# EAGLE schematic witch-dekatron1 (EAGLE 6.4)
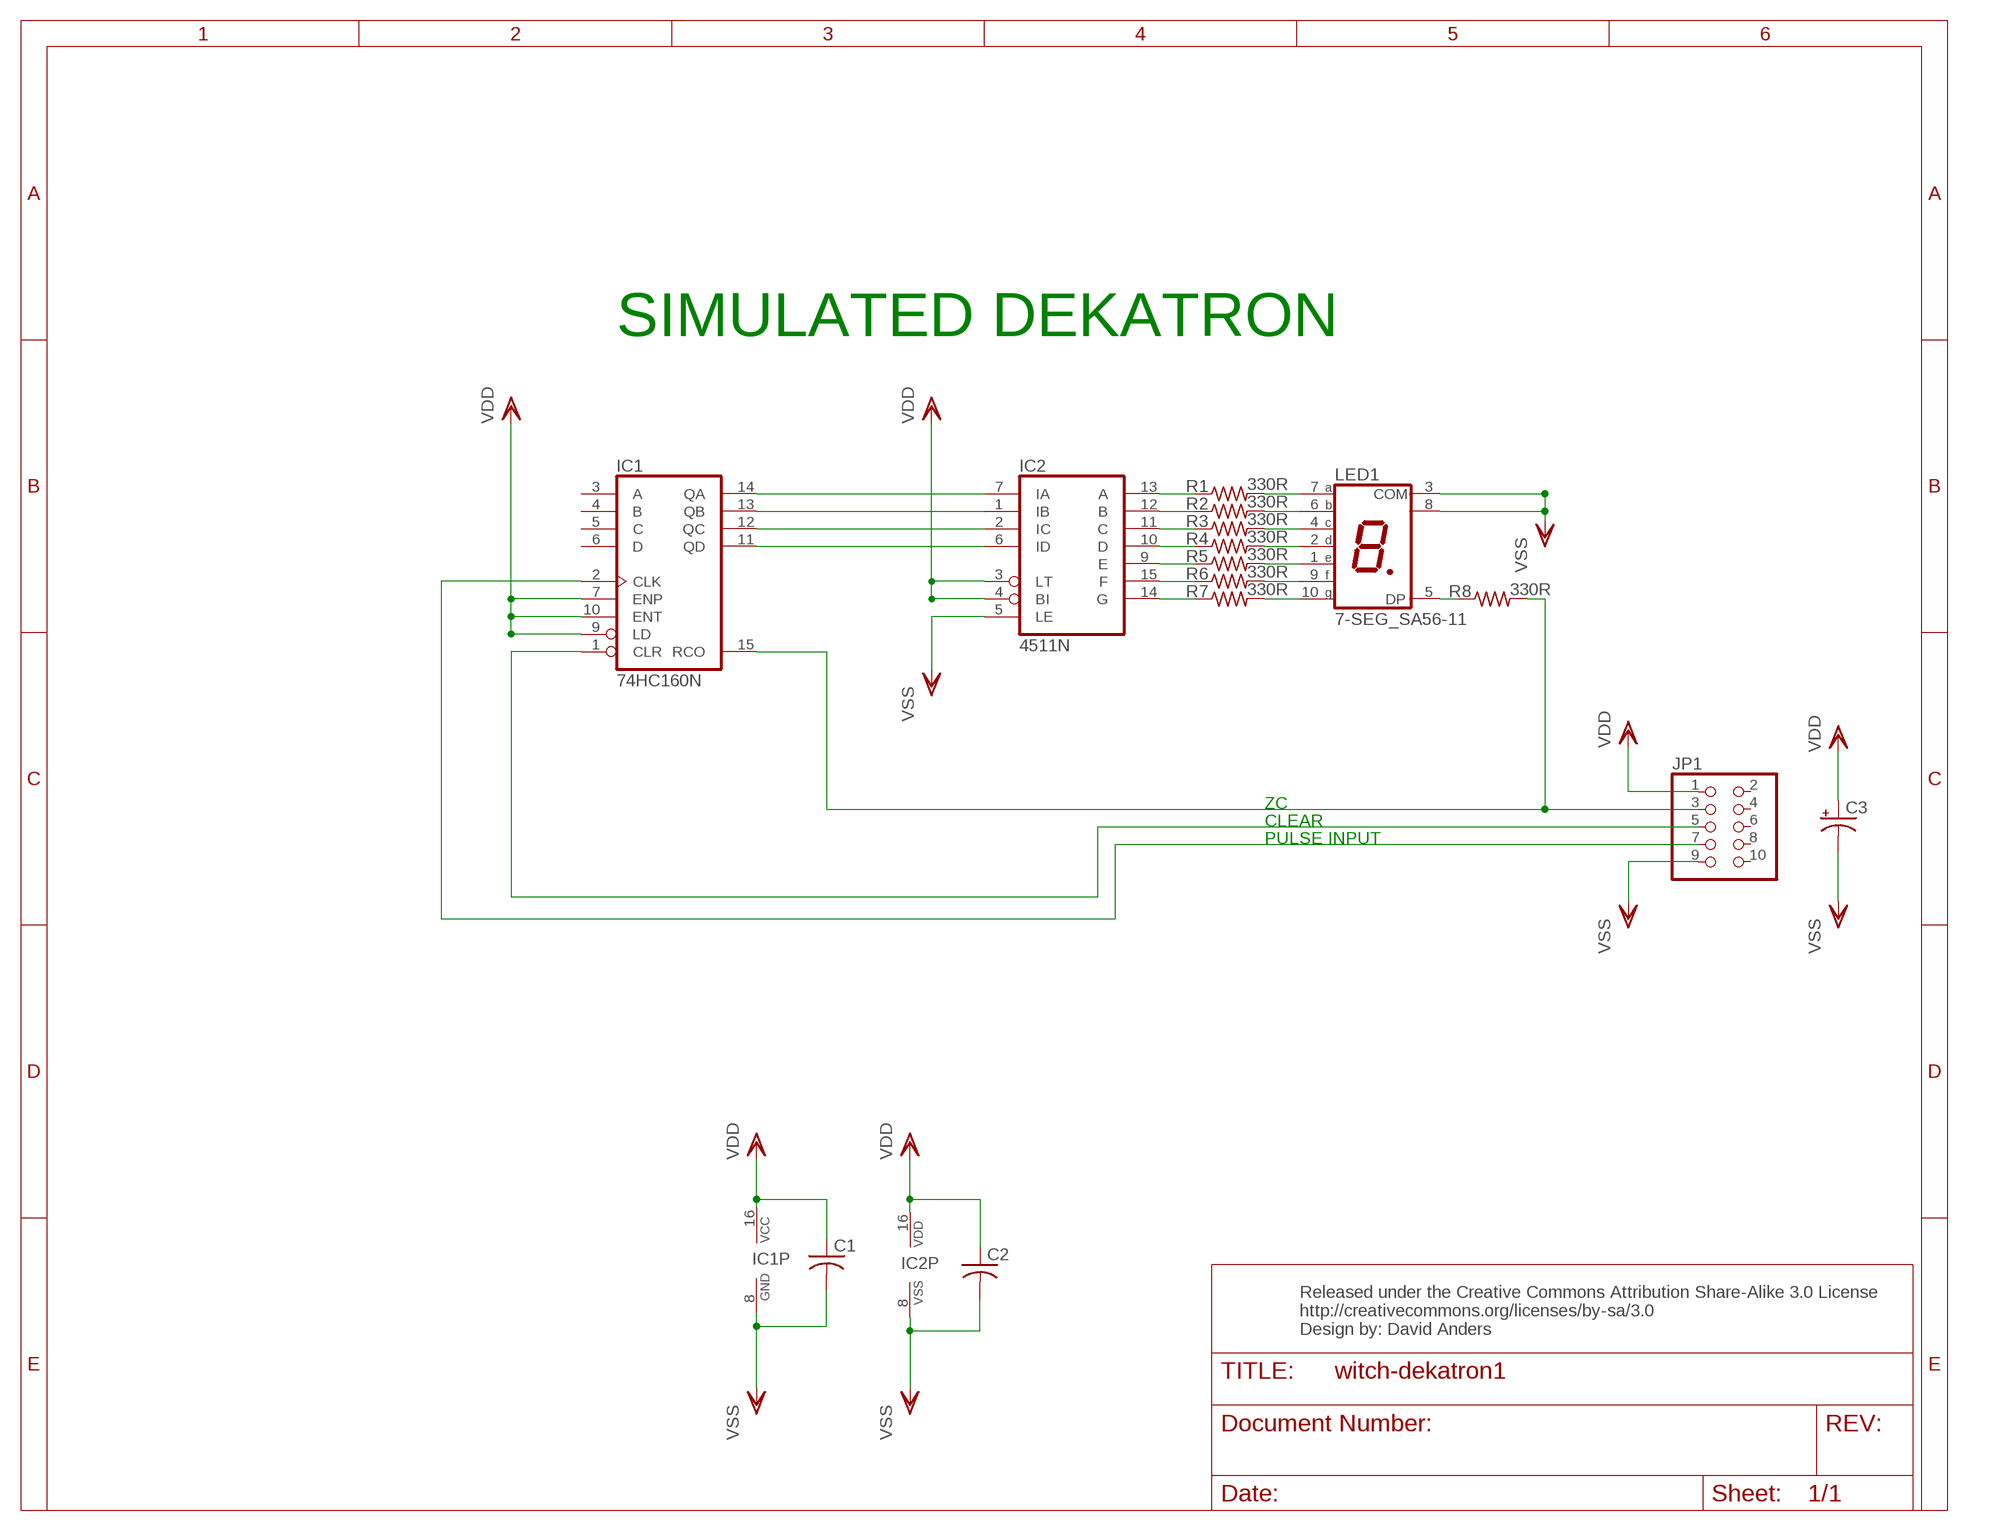
[diagram p0: schematic, sheet 1]

## Parts
C1  C-US025-025X050  [C025-025X050]
C2  C-US025-025X050  [C025-025X050]
C3  CPOL-USE2-5  [E2-5]
IC1  74HC160N  [DIL16]
IC2  4511N  [DIL16]
JP1  PINHD-2X5  [2X05]
LED1  7-SEG_SA56-11  [SA56-11]
R1  330R  R-US_0204/5  [0204/5]
R2  330R  R-US_0204/5  [0204/5]
R3  330R  R-US_0204/5  [0204/5]
R4  330R  R-US_0204/5  [0204/5]
R5  330R  R-US_0204/5  [0204/5]
R6  330R  R-US_0204/5  [0204/5]
R7  330R  R-US_0204/5  [0204/5]
R8  330R  R-US_0204/5  [0204/5]

## Nets
N$1: IC1.15(RCO) JP1.3 R8.2
N$2: IC1.1(CLR) JP1.5
N$3: IC2.13(A) R1.1
N$4: IC2.12(B) R2.1
N$5: IC2.11(C) R3.1
N$6: IC2.10(D) R4.1
N$7: IC2.9(E) R5.1
N$8: IC2.15(F) R6.1
N$9: IC2.14(G) R7.1
N$10: IC1.14(QA) IC2.7(IA)
N$11: IC1.13(QB) IC2.1(IB)
N$12: IC1.12(QC) IC2.2(IC)
N$13: IC1.11(QD) IC2.6(ID)
N$14: LED1.7(A) R1.2
N$15: LED1.6(B) R2.2
N$16: LED1.4(C) R3.2
N$17: LED1.2(D) R4.2
N$18: LED1.1(E) R5.2
N$19: LED1.9(F) R6.2
N$20: LED1.10(G) R7.2
N$21: LED1.5(DP) R8.1
N$25: IC1.2(CLK) JP1.7
VDD: C1.1 C2.1 C3.+ IC1.7(ENP) IC1.9(LD) IC1.10(ENT) IC1.16(VCC) IC2.3(LT) IC2.4(BI) IC2.16(VDD) JP1.1
VSS: C1.2 C2.2 C3.- IC1.8(GND) IC2.5(LE) IC2.8(VSS) JP1.9 LED1.3(COM) LED1.8(COM)
Unconnected: IC1.3(A) IC1.4(B) IC1.5(C) IC1.6(D) JP1.2 JP1.4 JP1.6 JP1.8 JP1.10

## Notes on the sheet
- SIMULATED DEKATRON
- ZC
- CLEAR
- PULSE INPUT
- Released under the Creative Commons Attribution Share-Alike 3.0 License
  http://creativecommons.org/licenses/by-sa/3.0
  Design by: David Anders

## Library data of the parts
C1 C2 = resistor:C-US: CAPACITOR, American symbol
C3 = resistor:CPOL-US: POLARIZED CAPACITOR, American symbol
IC1 = 74xx-eu:74*160: Synchronous 4-bit COUNTER
IC2 = 45xx:4511: BCD to 7-segment LATCH/DECODER/DRIVER
JP1 = pinhead:PINHD-2X5: PIN HEADER
LED1 = display-kingbright:7-SEG_: Kingbright 14.2mm (0.56 INCH) SINGLE DIGIT NUMERIC DUISPLAY Source: SA56-11EWA(Ver1189471036.pdf; OC_FARNELL: unknown; OC_NEWARK: unknown
R1-R8 = resistor:R-US_: RESISTOR, American symbol